# EAGLE schematic controller (EAGLE 6.2)
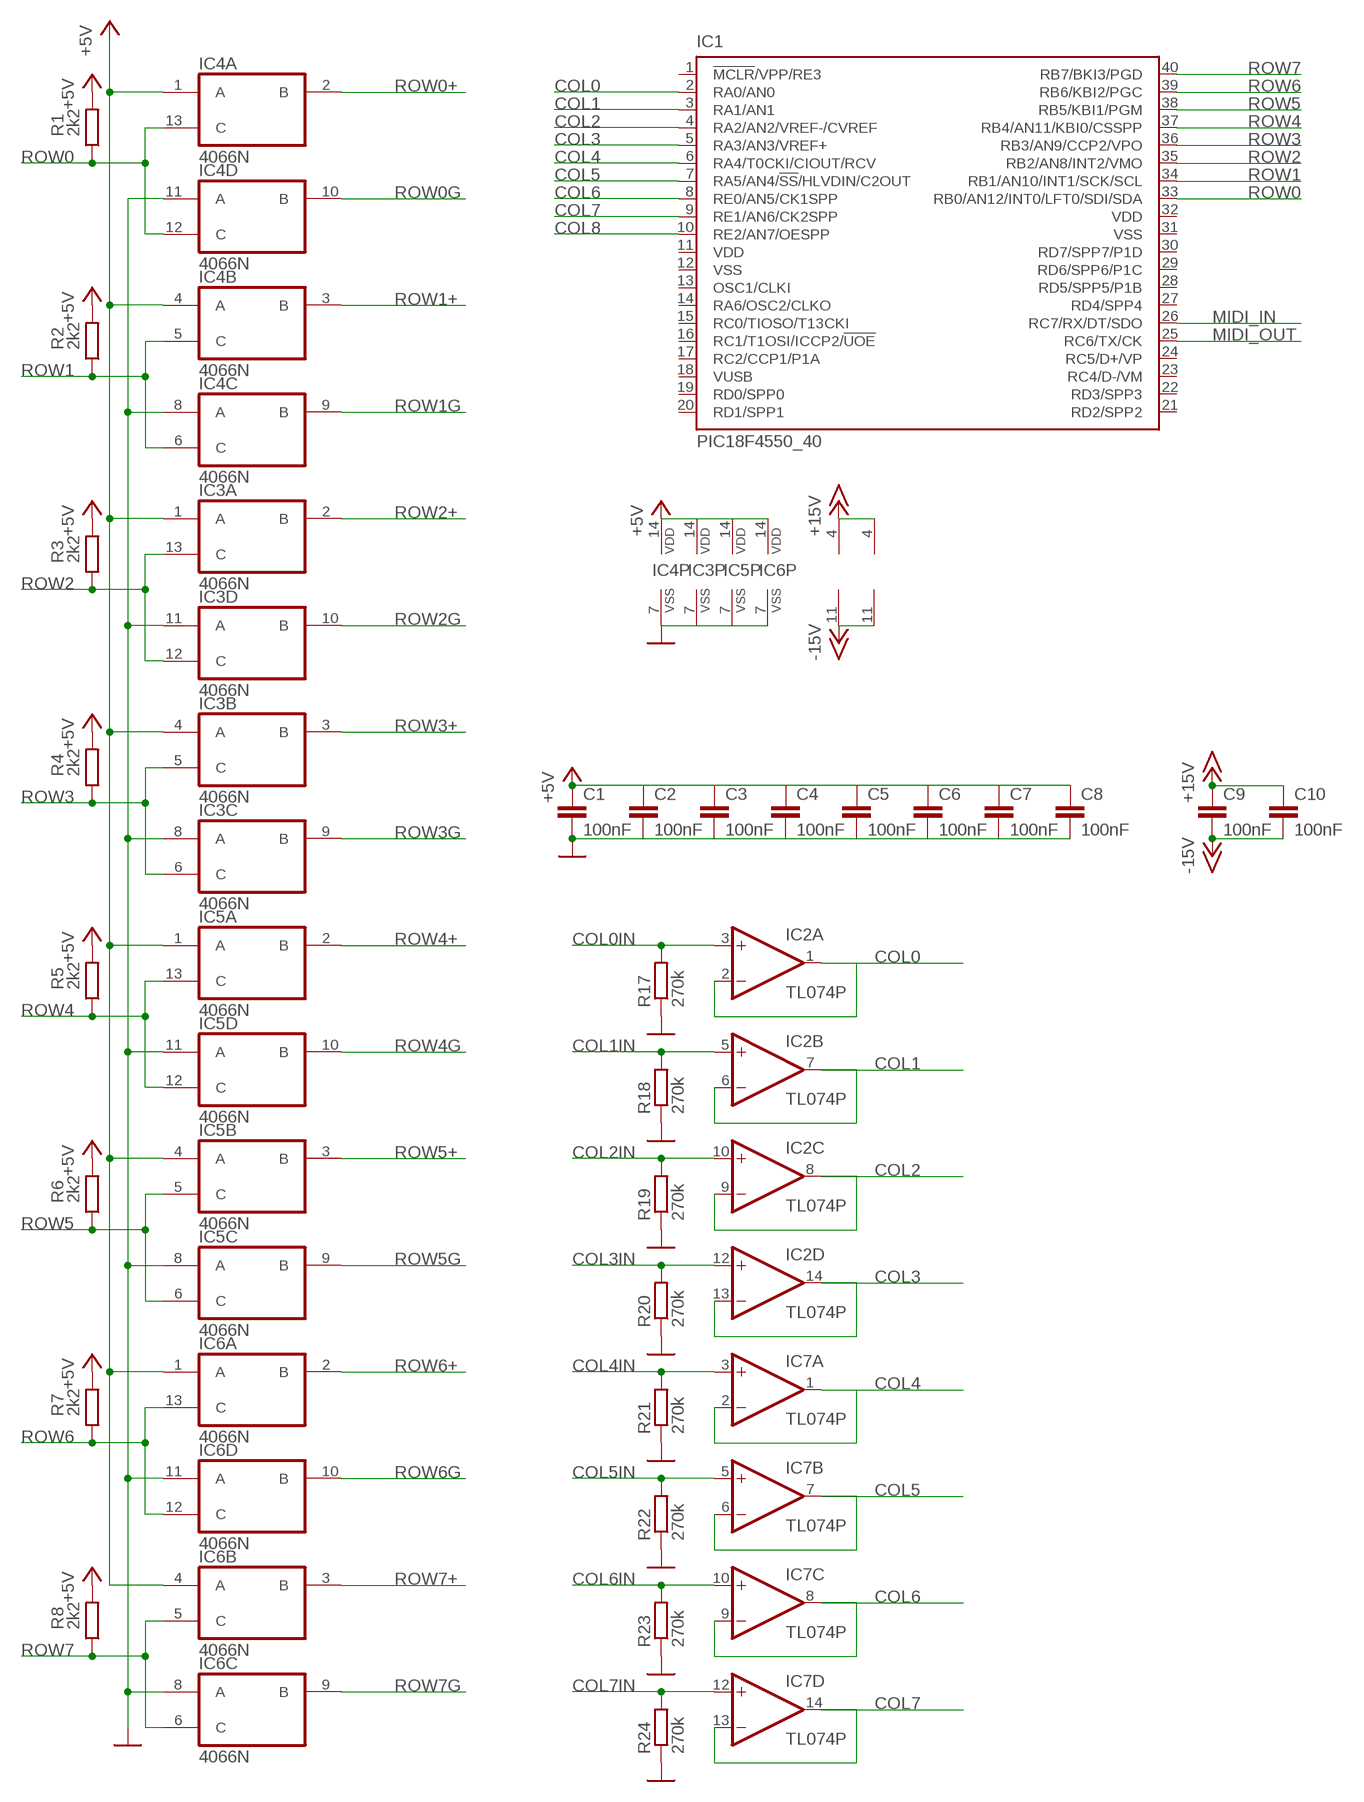
[diagram p0: schematic, sheet 1]

## Parts
C1  100nF  C-EU025-024X044  [C025-024X044]
C2  100nF  C-EU025-024X044  [C025-024X044]
C3  100nF  C-EU025-024X044  [C025-024X044]
C4  100nF  C-EU025-024X044  [C025-024X044]
C5  100nF  C-EU025-024X044  [C025-024X044]
C6  100nF  C-EU025-024X044  [C025-024X044]
C7  100nF  C-EU025-024X044  [C025-024X044]
C8  100nF  C-EU025-024X044  [C025-024X044]
C9  100nF  C-EU025-024X044  [C025-024X044]
C10  100nF  C-EU025-024X044  [C025-024X044]
IC1  PIC18F4550_40  [DIL40]
IC2  TL074P  [DIL14]
IC3  4066N  [DIL14]
IC4  4066N  [DIL14]
IC5  4066N  [DIL14]
IC6  4066N  [DIL14]
IC7  TL074P  [DIL14]
R1  2k2  R-EU_0204/7  [0204/7]
R2  2k2  R-EU_0204/7  [0204/7]
R3  2k2  R-EU_0204/7  [0204/7]
R4  2k2  R-EU_0204/7  [0204/7]
R5  2k2  R-EU_0204/7  [0204/7]
R6  2k2  R-EU_0204/7  [0204/7]
R7  2k2  R-EU_0204/7  [0204/7]
R8  2k2  R-EU_0204/7  [0204/7]
R17  270k  R-EU_0204/7  [0204/7]
R18  270k  R-EU_0204/7  [0204/7]
R19  270k  R-EU_0204/7  [0204/7]
R20  270k  R-EU_0204/7  [0204/7]
R21  270k  R-EU_0204/7  [0204/7]
R22  270k  R-EU_0204/7  [0204/7]
R23  270k  R-EU_0204/7  [0204/7]
R24  270k  R-EU_0204/7  [0204/7]

## Nets
+5V: C1.1 C2.1 C3.1 C4.1 C5.1 C6.1 C7.1 C8.1 IC3.1(A:A) IC3.4(B:A) IC3.14(P:VDD) IC4.1(A:A) IC4.4(B:A) IC4.14(P:VDD) IC5.1(A:A) IC5.4(B:A) IC5.14(P:VDD) IC6.1(A:A) IC6.4(B:A) IC6.14(P:VDD) R1.2 R2.2 R3.2 R4.2 R5.2 R6.2 R7.2 R8.2
+15V: C9.1 C10.1 IC2.4(P:V+) IC7.4(P:V+)
-15V: C9.2 C10.2 IC2.11(P:V-) IC7.11(P:V-)
COL0: IC1.2(RA0/AN0) IC2.1(A:OUT) IC2.2(A:-IN)
COL0IN: IC2.3(A:+IN) R17.2
COL1: IC1.3(RA1/AN1) IC2.6(B:-IN) IC2.7(B:OUT)
COL1IN: IC2.5(B:+IN) R18.2
COL2: IC1.4(RA2/AN2/VREF-/CVREF) IC2.8(C:OUT) IC2.9(C:-IN)
COL2IN: IC2.10(C:+IN) R19.2
COL3: IC1.5(RA3/AN3/VREF+) IC2.13(D:-IN) IC2.14(D:OUT)
COL3IN: IC2.12(D:+IN) R20.2
COL4: IC1.6(RA4/T0CKI/CIOUT/RCV) IC7.1(A:OUT) IC7.2(A:-IN)
COL4IN: IC7.3(A:+IN) R21.2
COL5: IC1.7(RA5/AN4/!SS!/HLVDIN/C2OUT) IC7.6(B:-IN) IC7.7(B:OUT)
COL5IN: IC7.5(B:+IN) R22.2
COL6: IC1.8(RE0/AN5/CK1SPP) IC7.8(C:OUT) IC7.9(C:-IN)
COL6IN: IC7.10(C:+IN) R23.2
COL7: IC1.9(RE1/AN6/CK2SPP) IC7.13(D:-IN) IC7.14(D:OUT)
COL7IN: IC7.12(D:+IN) R24.2
COL8: IC1.10(RE2/AN7/OESPP)
GND: C1.2 C2.2 C3.2 C4.2 C5.2 C6.2 C7.2 C8.2 IC3.7(P:VSS) IC3.8(C:A) IC3.11(D:A) IC4.7(P:VSS) IC4.8(C:A) IC4.11(D:A) IC5.7(P:VSS) IC5.8(C:A) IC5.11(D:A) IC6.7(P:VSS) IC6.8(C:A) IC6.11(D:A) R17.1 R18.1 R19.1 R20.1 R21.1 R22.1 R23.1 R24.1
MIDI_IN: IC1.26(RC7/RX/DT/SDO)
MIDI_OUT: IC1.25(RC6/TX/CK)
ROW0: IC1.33(RB0/AN12/INT0/LFT0/SDI/SDA) IC4.12(D:C) IC4.13(A:C) R1.1
ROW0+: IC4.2(A:B)
ROW0G: IC4.10(D:B)
ROW1: IC1.34(RB1/AN10/INT1/SCK/SCL) IC4.5(B:C) IC4.6(C:C) R2.1
ROW1+: IC4.3(B:B)
ROW1G: IC4.9(C:B)
ROW2: IC1.35(RB2/AN8/INT2/VMO) IC3.12(D:C) IC3.13(A:C) R3.1
ROW2+: IC3.2(A:B)
ROW2G: IC3.10(D:B)
ROW3: IC1.36(RB3/AN9/CCP2/VPO) IC3.5(B:C) IC3.6(C:C) R4.1
ROW3+: IC3.3(B:B)
ROW3G: IC3.9(C:B)
ROW4: IC1.37(RB4/AN11/KBI0/CSSPP) IC5.12(D:C) IC5.13(A:C) R5.1
ROW4+: IC5.2(A:B)
ROW4G: IC5.10(D:B)
ROW5: IC1.38(RB5/KBI1/PGM) IC5.5(B:C) IC5.6(C:C) R6.1
ROW5+: IC5.3(B:B)
ROW5G: IC5.9(C:B)
ROW6: IC1.39(RB6/KBI2/PGC) IC6.12(D:C) IC6.13(A:C) R7.1
ROW6+: IC6.2(A:B)
ROW6G: IC6.10(D:B)
ROW7: IC1.40(RB7/BKI3/PGD) IC6.5(B:C) IC6.6(C:C) R8.1
ROW7+: IC6.3(B:B)
ROW7G: IC6.9(C:B)
Unconnected: IC1.1(!MCLR!/VPP/RE3) IC1.13(OSC1/CLKI) IC1.14(RA6/OSC2/CLKO) IC1.15(RC0/TIOSO/T13CKI) IC1.16(RC1/T1OSI/ICCP2/!UOE) IC1.17(RC2/CCP1/P1A) IC1.18(VUSB) IC1.19(RD0/SPP0) IC1.20(RD1/SPP1) IC1.21(RD2/SPP2) IC1.22(RD3/SPP3) IC1.23(RC4/D-/VM) IC1.24(RC5/D+/VP) IC1.27(RD4/SPP4) IC1.28(RD5/SPP5/P1B) IC1.29(RD6/SPP6/P1C) IC1.30(RD7/SPP7/P1D)

## Power pins joined to a net without a drawn wire
VDD: IC1.11(VDD) IC1.32(VDD)
VSS: IC1.12(VSS) IC1.31(VSS)

## Library data of the parts
C1-C10 = resistor:C-EU: CAPACITOR, European symbol
IC1 = microchip:PIC18F4*_40: USB Microcontrollers with nanoWatt Technology High-Performance, Enhanced Flash, 28/40/44-Pin, Source: http://ww1.microchip.com/downloads/en/devicedoc/39632c.pdf; MF: MICROCHIP; MPN: PIC18F4550-I/P; OC_FARNELL: 9321357; OC_NEWARK: 74K8623
IC2 IC7 = linear:TL074: OP AMP
IC3-IC6 = 40xx:4066: Quad bilateral ANALOG SWITCH
R1-R8 R17-R24 = resistor:R-EU_: RESISTOR, European symbol